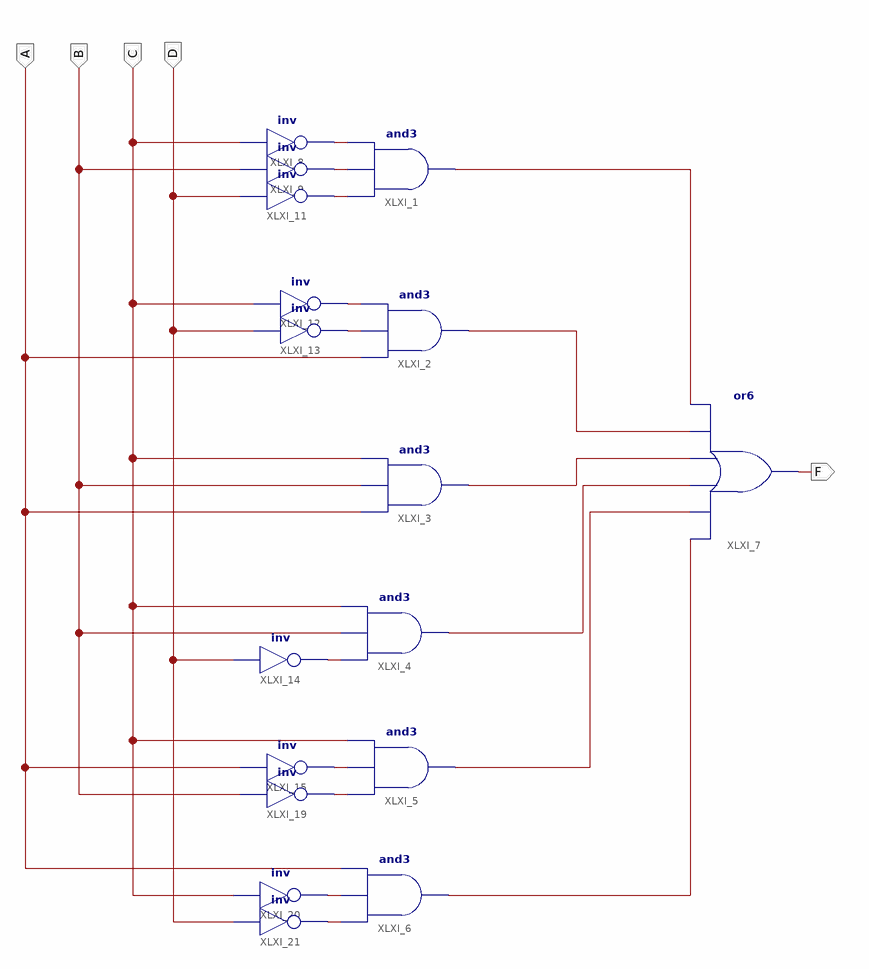
[diagram p0: schematic sheet 1]
// Xilinx ISE schematic schema.sch (spartan3e) as structural Verilog: 17 symbols, 5 ports
module schema (
  input  A,
  input  B,
  input  C,
  input  D,
  output F
);

  wire XLXN_1, XLXN_2, XLXN_3, XLXN_4, XLXN_5, XLXN_6, XLXN_7, XLXN_11, XLXN_12, XLXN_13, XLXN_19, XLXN_20,
       XLXN_21, XLXN_22, XLXN_23, XLXN_25;

  and XLXI_1 (XLXN_19, XLXN_3, XLXN_2, XLXN_1);
  and XLXI_2 (XLXN_20, A, XLXN_5, XLXN_4);
  and XLXI_3 (XLXN_21, A, B, C);
  and XLXI_4 (XLXN_22, XLXN_6, B, C);
  and XLXI_5 (XLXN_23, XLXN_11, XLXN_7, C);
  and XLXI_6 (XLXN_25, XLXN_13, XLXN_12, A);
  or XLXI_7 (F, XLXN_25, XLXN_23, XLXN_22, XLXN_21, XLXN_20, XLXN_19);
  not XLXI_8 (XLXN_1, C);
  not XLXI_9 (XLXN_2, B);
  not XLXI_11 (XLXN_3, D);
  not XLXI_12 (XLXN_4, C);
  not XLXI_13 (XLXN_5, D);
  not XLXI_14 (XLXN_6, D);
  not XLXI_15 (XLXN_7, A);
  not XLXI_19 (XLXN_11, B);
  not XLXI_20 (XLXN_12, C);
  not XLXI_21 (XLXN_13, D);
endmodule
